# Altium project Laba1.PrjPcb
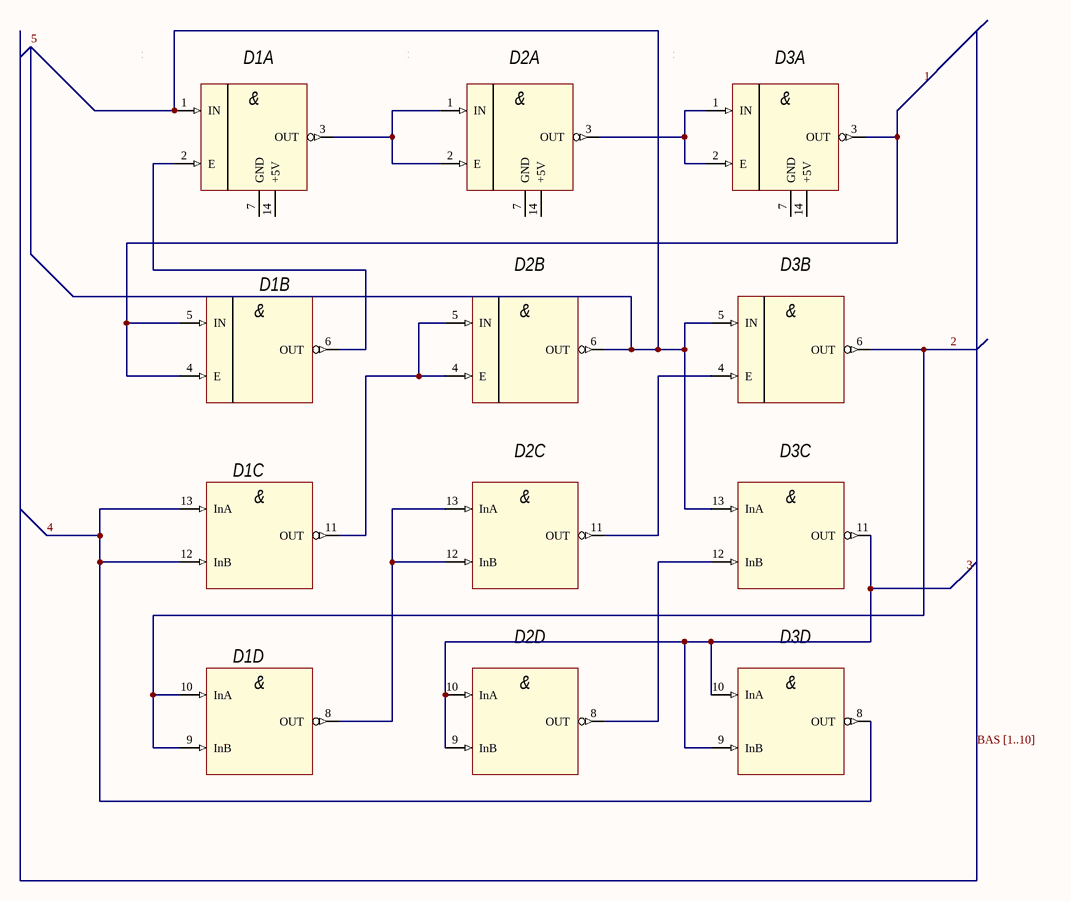
[diagram p0: Принципиальная электрическая схема.SchDoc]
2 sheets, 4 parts. Net scope: global (net labels, ports and power ports of the same name join across sheets).
Board file: Печатная плата.PcbDoc
Sheets:
  Принципиальная электрическая схема.SchDoc
  Sheet1.SchDoc

## Sheet Принципиальная электрическая схема.SchDoc
size A4; SheetNumber: 1; SheetTotal: 1

### Parts
D1  НЕ-И  [DIP14]  (value not drawn)  (parts A,B,C,D of 4)
D2  НЕ-И  [DIP14]  (value not drawn)  (parts A,B,C,D of 4)
D3  НЕ-И  [DIP14]  (value not drawn)  (parts A,B,C,D of 4)

### Nets
1: D1.4(E) D1.5(IN) D3.3(OUT)
2: D1.9(InB) D1.10(InA) D3.6(OUT)
3: D2.9(InB) D2.10(InA) D3.9(InB) D3.10(InA) D3.11(OUT)
4: D1.12(InB) D1.13(InA) D3.8(OUT)
5: D1.1(IN) D2.6(OUT) D3.5(IN) D3.13(InA)
NetD1_2: D1.2(E) D1.6(OUT)
NetD1_3: D1.3(OUT) D2.1(IN) D2.2(E)
NetD1_8: D1.8(OUT) D2.12(InB) D2.13(InA)
NetD1_11: D1.11(OUT) D2.4(E) D2.5(IN)
NetD2_3: D2.3(OUT) D3.1(IN) D3.2(E)
NetD2_8: D2.8(OUT) D3.12(InB)
NetD2_11: D2.11(OUT) D3.4(E)

Not connected (* = marked no-connect by the designer): D1 7(GND) 14(+5V); D2 7(GND) 14(+5V); D3 7(GND) 14(+5V)

### Buses and harness runs
bus BAS [1..10]

### Notes on the sheet
- (in symbol НЕ-И, part A) &
- (in symbol НЕ-И, part B) &
- (in symbol НЕ-И, part C) &
- (in symbol НЕ-И, part D) &

## Sheet Sheet1.SchDoc
size A4; SheetNumber: 2; SheetTotal: 2
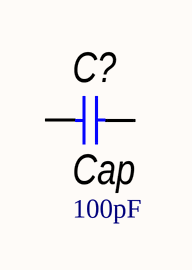
[diagram p1: Sheet1.SchDoc]

### Parts
C?  Cap  value 100pF  [RAD-0.3]

### Nets

Not connected (* = marked no-connect by the designer): C? 1 2

### Library data of the parts
C? = Cap: Capacitor; Published: 8-Jun-2000; LatestRevisionDate: 17-Jul-2002; LatestRevisionNote: Re-released for DXP Platform.; PackageReference: RAD-0.3; Publisher: Altium Limited; PackageDescription: Radial Cap, Thru-Hole; 2 Leads; 0.3 in Pin Spacing